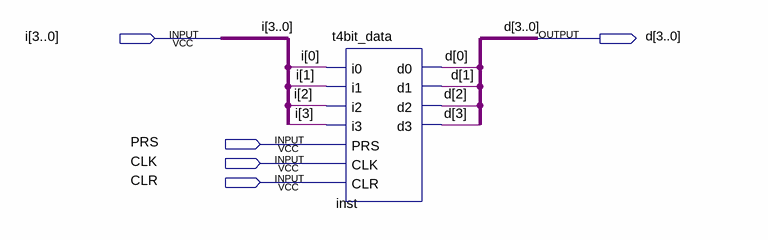
[diagram p0: schematic sheet]
// Quartus schematic t4bit_data_bus.bdf as structural Verilog: 1 symbols, 5 pins
module t4bit_data_bus (
  input  [3:0] i,
  input  PRS,
  input  CLK,
  input  CLR,
  output [3:0] d
);

  t4bit_data inst (
    .i0(i[0]), .i1(i[1]), .i2(i[2]), .i3(i[3]), .PRS(PRS), .CLK(CLK), .CLR(CLR), .d0(d[0]), .d1(d[1]),
    .d2(d[2]), .d3(d[3]));
endmodule
